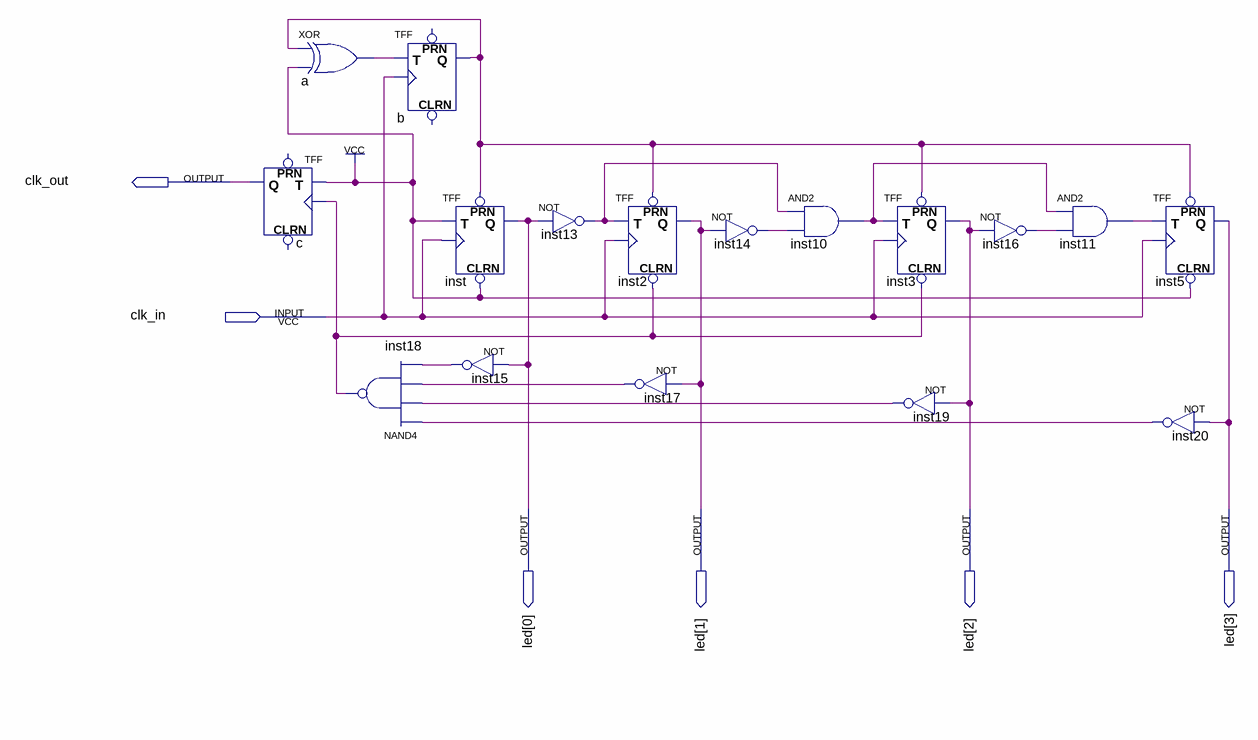
[diagram p0: schematic sheet]
// Quartus schematic contador_sync_decresc_mod10.bdf as structural Verilog: 17 symbols, 6 pins
module contador_sync_decresc_mod10 (
  input  clk_in,
  output clk_out,
  output [3:0] led
);

  wire a_out, b_q, inst10_out, inst11_out, inst13_out, inst14_out, inst15_out, inst16_out, inst17_out,
       inst18_out, inst19_out, inst20_out;

  TFF c (.T(1'b1), .CLK(inst18_out), .Q(clk_out));  // open: PRN, CLRN
  xor a (a_out, b_q, 1'b1);
  nand inst18 (inst18_out, inst20_out, inst19_out, inst17_out, inst15_out);
  TFF b (.T(a_out), .CLK(clk_in), .Q(b_q));  // open: PRN, CLRN
  TFF inst (.PRN(b_q), .CLRN(1'b1), .T(1'b1), .CLK(clk_in), .Q(led[0]));
  not inst15 (inst15_out, led[0]);
  not inst13 (inst13_out, led[0]);
  TFF inst2 (.PRN(b_q), .CLRN(inst18_out), .T(inst13_out), .CLK(clk_in), .Q(led[1]));
  not inst17 (inst17_out, led[1]);
  not inst14 (inst14_out, led[1]);
  and inst10 (inst10_out, inst13_out, inst14_out);
  TFF inst3 (.PRN(b_q), .CLRN(inst18_out), .T(inst10_out), .CLK(clk_in), .Q(led[2]));
  not inst19 (inst19_out, led[2]);
  not inst16 (inst16_out, led[2]);
  and inst11 (inst11_out, inst10_out, inst16_out);
  TFF inst5 (.PRN(b_q), .CLRN(1'b1), .T(inst11_out), .CLK(clk_in), .Q(led[3]));
  not inst20 (inst20_out, led[3]);
endmodule
